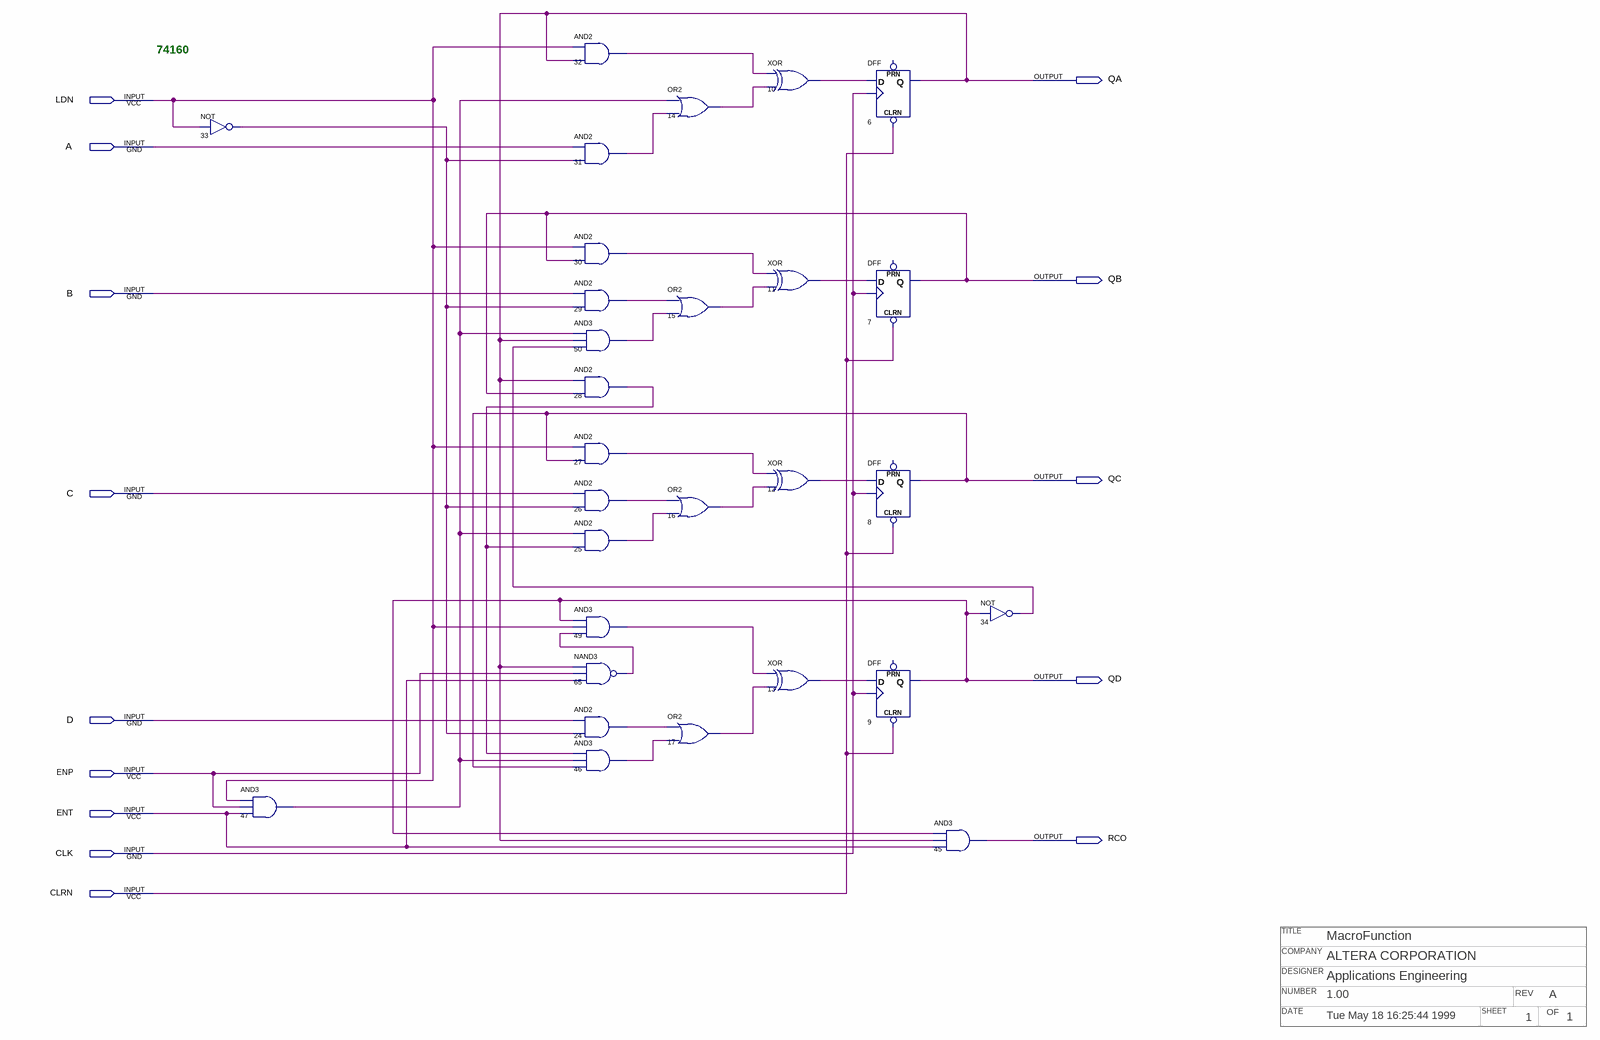
[diagram p0: schematic sheet]
// Quartus schematic 74160.bdf as structural Verilog: 29 symbols, 14 pins
// Title block: TITLE: MacroFunction; COMPANY: ALTERA CORPORATION; DESIGNER: Applications Engineering; NUMBER: 1.00; REV: A; DATE: Tue May 18 16:25:44 1999; SHEET: 1; OF: 1
module \74160  (
  input  LDN,
  input  A,
  input  B,
  input  C,
  input  D,
  input  ENP,
  input  ENT,
  input  CLK,
  input  CLRN,
  output QA,
  output QB,
  output QC,
  output QD,
  output RCO
);

  wire n10_out, n11_out, n12_out, n13_out, n14_out, n15_out, n16_out, n17_out, n24_out, n25_out, n26_out,
       n27_out, n28_out, n29_out, n30_out, n31_out, n32_out, n33_out, n34_out, n46_out, n47_out, n49_out,
       n50_out, n65_out;

  not u_33 (n33_out, LDN);
  and u_47 (n47_out, LDN, ENP, ENT);
  and u_32 (n32_out, LDN, QA);
  and u_31 (n31_out, A, n33_out);
  and u_30 (n30_out, LDN, QB);
  and u_29 (n29_out, B, n33_out);
  and u_50 (n50_out, n47_out, QA, n34_out);
  and u_28 (n28_out, QA, QB);
  and u_27 (n27_out, LDN, QC);
  and u_26 (n26_out, C, n33_out);
  and u_25 (n25_out, n47_out, n28_out);
  and u_49 (n49_out, QD, LDN, n65_out);
  nand u_65 (n65_out, QA, ENP, ENT);
  and u_24 (n24_out, D, n33_out);
  and u_46 (n46_out, n28_out, n47_out, QC);
  or u_14 (n14_out, n47_out, n31_out);
  or u_15 (n15_out, n29_out, n50_out);
  or u_16 (n16_out, n26_out, n25_out);
  or u_17 (n17_out, n24_out, n46_out);
  xor u_10 (n10_out, n32_out, n14_out);
  xor u_11 (n11_out, n30_out, n15_out);
  xor u_12 (n12_out, n27_out, n16_out);
  xor u_13 (n13_out, n49_out, n17_out);
  DFF u_6 (.CLRN(CLRN), .CLK(CLK), .D(n10_out), .Q(QA));  // open: PRN
  DFF u_7 (.CLRN(CLRN), .CLK(CLK), .D(n11_out), .Q(QB));  // open: PRN
  DFF u_8 (.CLRN(CLRN), .CLK(CLK), .D(n12_out), .Q(QC));  // open: PRN
  DFF u_9 (.CLRN(CLRN), .CLK(CLK), .D(n13_out), .Q(QD));  // open: PRN
  and u_45 (RCO, QD, QA, ENT);
  not u_34 (n34_out, QD);

  // Notes on the sheet:
  //   74160
endmodule
